# EAGLE schematic tractor_v2 (EAGLE 7.7.0)
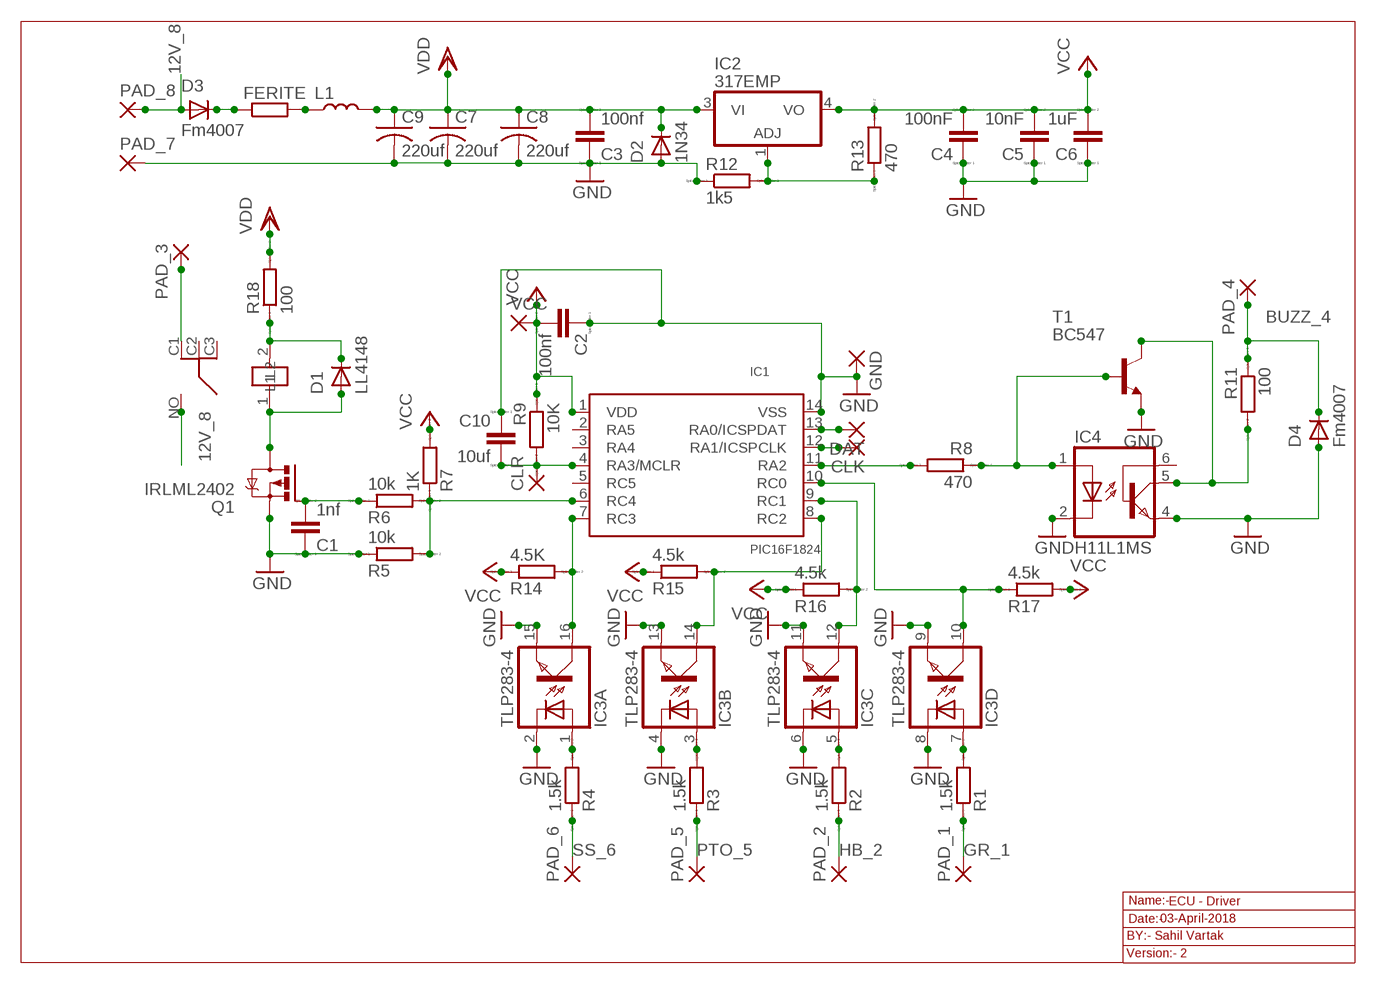
[diagram p0: schematic, sheet 1]

## Parts
C1  1nf  CC0603  [C0603]
C2  100nf  CC0603  [C0603]
C3  100nf  CC0603  [C0603]
C4  100nF  CC0603  [C0603]
C5  10nF  CC0603  [C0603]
C6  1uF  CC0603  [C0603]
C7  220uf  C-US025-025X050  [C025-025X050]
C8  220uf  C-US025-025X050  [C025-025X050]
C9  220uf  C-US025-025X050  [C025-025X050]
C10  10uf  CC0603  [C0603]
CLK  1,6/0,8  [1,6/0,8]
CLR  1,6/0,8  [1,6/0,8]
D1  LL4148  GF1  [SMA-DO214AC]
D2  1N34  GF1  [SMA-DO214AC]
D3  Fm4007  GF1  [SMA-DO214AC]
D4  Fm4007  GF1  [SMA-DO214AC]
DAT  1,6/0,8  [1,6/0,8]
FERITE  R-EU_R0603  [R0603]
GND  1,6/0,8  [1,6/0,8]
IC1  PIC16F1824  [SO-14]
IC2  317EMP  [SOT223]
IC3  TLP283-4  [MINI-FLAT-16]
IC4  H11L1MS  [DIL6-SMD]
K2  RL703  [RL703]
L1  R-US_WSC2515  [WSC2515]
PAD_1  2,54/1,1  [2,54/1,1]
PAD_2  2,54/1,1  [2,54/1,1]
PAD_3  2,54/1,1  [2,54/1,1]
PAD_4  2,54/1,1  [2,54/1,1]
PAD_5  2,54/1,1  [2,54/1,1]
PAD_6  2,54/1,1  [2,54/1,1]
PAD_7  2,54/1,1  [2,54/1,1]
PAD_8  2,54/1,1  [2,54/1,1]
Q1  IRLML2402  IRLML5203  [MICRO3]
R1  1.5k  RR0603  [R0603]
R2  1.5k  RR0603  [R0603]
R3  1.5k  RR0603  [R0603]
R4  1.5k  RR0603  [R0603]
R5  10k  RR0603  [R0603]
R6  10k  RR0603  [R0603]
R7  1K  RR0603  [R0603]
R8  470  RR0603  [R0603]
R9  10K  RR0603  [R0603]
R11  100  RR0603  [R0603]
R12  1k5  RR0603  [R0603]
R13  470  RR0603  [R0603]
R14  4.5K  RR0603  [R0603]
R15  4.5k  RR0603  [R0603]
R16  4.5k  RR0603  [R0603]
R17  4.5k  RR0603  [R0603]
R18  100  RR0603  [R0603]
T1  BC547  [TO92]
VCC  1,6/0,8  [1,6/0,8]

## Nets
12V_8: D3.A K2.NO PAD_8.1(P)
BUZZ_4: D4.K(C) PAD_4.1(P) R11.1
GND: C1.1 C2.1 C3.1 C4.1 C5.1 C6.1 C7.2 C8.2 C9.2 C10.1 D2.A D4.A GND.1(P) IC1.14(VSS) IC3.2(A:C) IC3.4(B:C) IC3.6(C:C) IC3.8(D:C) IC3.9(D:EMIT) IC3.11(C:EMIT) IC3.13(B:EMIT) IC3.15(A:EMIT) IC4.2(C) IC4.4(EMI) PAD_7.1(P) Q1.2(S) R5.1 R12.1 T1.1(E)
GR_1: PAD_1.1(P) R1.1
HB_2: PAD_2.1(P) R2.1
N$3: IC1.10(RC0) IC3.10(D:COL) R17.1
N$5: D1.A K2.1(L2) Q1.3(D)
N$7: D3.K(C) FERITE.1
N$8: DAT.1(P) IC1.13(RA0/ICSPDAT)
N$9: CLK.1(P) IC1.12(RA1/ICSPCLK)
N$13: D1.K(C) K2.2(L1) R18.1
N$14: IC2.1(ADJ) R12.2 R13.1
N$15: FERITE.2 L1.1
N$72: C1.2 Q1.1(G) R6.1
N$74: IC1.6(RC4) R5.2 R6.2 R7.1
N$76: IC3.1(A:A) R4.2
N$78: IC3.3(B:A) R3.2
N$80: IC3.5(C:A) R2.2
N$82: IC3.7(D:A) R1.2
N$84: IC1.9(RC1) IC3.12(C:COL) R16.2
N$85: IC1.8(RC2) IC3.14(B:COL) R15.2
N$86: IC1.7(RC3) IC3.16(A:COL) R14.2
N$87: C10.2 CLR.1(P) IC1.4(RA3/MCLR) R9.2
N$88: IC1.11(RA2) R8.2
N$89: IC4.1(A) R8.1 T1.2(B)
N$90: IC4.5(COL) R11.2 T1.3(C)
PTO_5: PAD_5.1(P) R3.1
R_3: K2.C1 PAD_3.1(P)
SS_6: PAD_6.1(P) R4.1
VCC: C2.2 C4.2 C5.2 C6.2 IC1.1(VDD) IC2.4(VO) R7.2 R9.1 R13.2 R14.1 R15.1 R16.1 R17.2 VCC.1(P)
VDD: C3.2 C7.1 C8.1 C9.1 D2.K(C) IC2.3(VI) L1.2 R18.2
Unconnected: IC1.2(RA5) IC1.3(RA4) IC1.5(RC5) IC4.6(BAS) K2.C2 K2.C3

## Notes on the sheet
- Name:- | ECU - Driver
- Date:- | 03-April-2018
- BY:- Sahil Vartak
- Version:- 2

## Library data of the parts
C1-C6 C10 = eagle-ltspice:C: CAPACITOR, European symbol; SPICEMODEL: NONE; SPICEPREFIX: C
C7-C9 = rcl:C-US: CAPACITOR, American symbol
CLK CLR DAT GND VCC = wirepad:1,6/0,8: THROUGH-HOLE PAD
D1-D4 = diode:GF1: DIODE
FERITE = resistor:R-EU_: RESISTOR, European symbol
IC1 = microchip:PIC16F1824
IC2 = lm317:*317: Positive VOLTAGE REGULATOR
IC3 = optocoupler:TLP283-4: TOSHIBA PHOTOCOUPLER GaAs IRED & PHOTO-TRANSISTOR Source: http://www.semicon.toshiba.co.jp/td/en/Opto/Photocoupler/en_20050928_TLP283_datasheet.pdf; OC_FARNELL: unknown; OC_NEWARK: unknown
IC4 = optocoupler:H11L*M: 6-Pin DIP Optocoupler Source: http://www.fairchildsemi.com/ds/H1/H11L2-M.pdf; OC_FARNELL: unknown; OC_NEWARK: unknown
K2 = relay:RL703
L1 = resistor:R-US_: RESISTOR, American symbol
PAD_1-PAD_8 = wirepad:2,54/1,1: THROUGH-HOLE PAD
Q1 = transistor-power:IRLML5203: HEXFET P-Channel Power MOSFET
R1-R9 R11-R18 = eagle-ltspice:R: RESISTOR, European symbol; SPICEMODEL: NONE; SPICEPREFIX: R
T1 = transistor-neu-to92:BC547: NPN TRANSISTOR